# Altium schematic sheet Boot Leg.SchDoc
size A; SheetNumber: 11; SheetTotal: 12
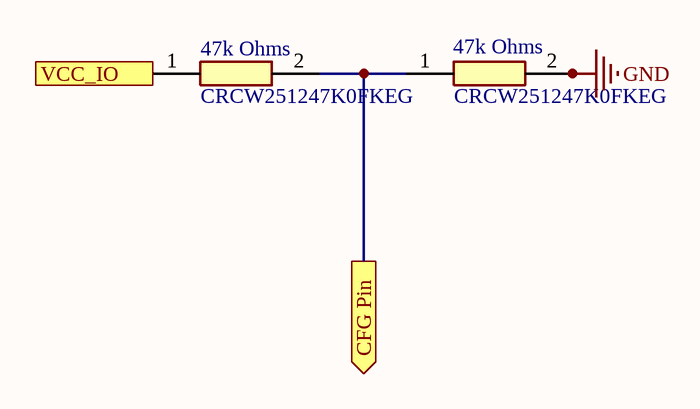
[diagram p0: Boot Leg.SchDoc]

## Parts
(Parts that share a designator on the sheet are numbered #1, #2 ... from top to bottom, then left to right.)
47k_Ohms#1  CRCW251247K0FKEG  [RESC6332X70N]
47k_Ohms#2  CRCW251247K0FKEG  [RESC6332X70N]

## Ports
CFG Pin (out), VCC_IO (in)

## Nets
GND: 47k_Ohms#2.2
CFG Pin: 47k_Ohms#1.2 47k_Ohms#2.1 ; port CFG Pin
VCC_IO: 47k_Ohms#1.1 ; port VCC_IO

## Library data of the parts
47k_Ohms#1 47k_Ohms#2 = CRCW251247K0FKEG: Resistor; Manufacturer_Name: Vishay; Datasheet Link: http://www.vishay.com/docs/20035/dcrcwe3.pdf; Height: 0.7mm; Manufacturer_Part_Number: CRCW251247K0FKEG; Mouser Part Number: 71-CRCW251247K0FKEG; Mouser Price/Stock: https://www.mouser.co.uk/ProductDetail/Vishay-Dale/CRCW251247K0FKEG?qs=%2FRekKqkAqKDD3RyILxwW4Q%3D%3D